# EAGLE design ESC Board 1 (EAGLE 7.5.0)
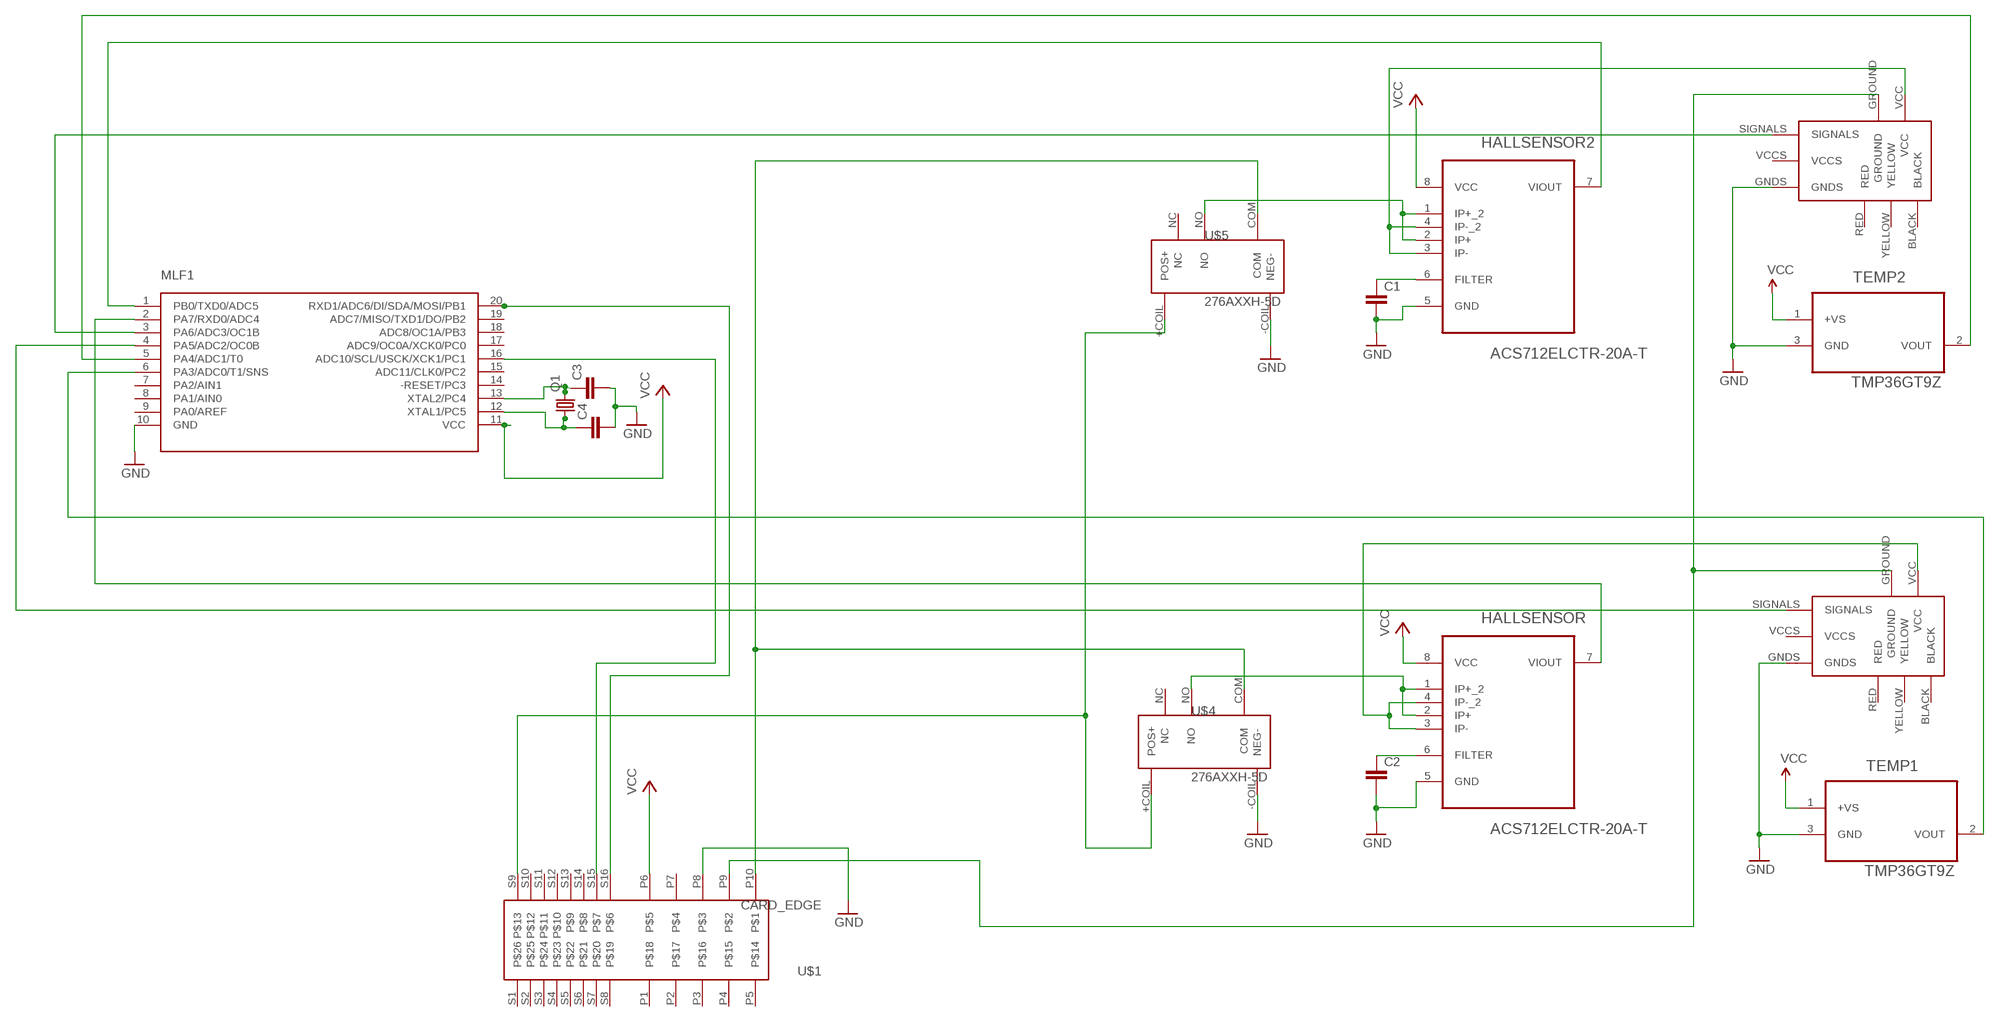
[diagram p0: schematic, sheet 1]

## Parts
C1  CAPEZ  [CAP-PTH-SMALLEZ]
C2  CAPEZ  [CAP-PTH-SMALLEZ]
C3  CAPEZ  [CAP-PTH-SMALLEZ]
C4  CAPEZ  [CAP-PTH-SMALLEZ]
HALLSENSOR  ACS712ELCTR-20A-T  [SOIC127P600X175-8N]
HALLSENSOR2  ACS712ELCTR-20A-T  [SOIC127P600X175-8N]
MLF1  ATTINY1634SOIC20  [SOIC20]
Q1  CRYTALTC26V  [TC26V]
TEMP1  TMP36GT9Z  [TO127P254X533-3P]
TEMP2  TMP36GT9Z  [TO127P254X533-3P]
U$1  CARD_EDGE  [EDGE_CONNECTOR]
U$2  ESC30A  [30AESC]
U$3  ESC30A  [30AESC]
U$4  276AXXH-5D  [276AXXH-5D]
U$5  276AXXH-5D  [276AXXH-5D]

## Nets
BAT-: U$1.P9 U$2.GROUND U$3.GROUND
GND: C1.2 C2.2 C3.2 C4.2 HALLSENSOR2.5(GND) HALLSENSOR.5(GND) MLF1.10(GND) TEMP1.3(GND) TEMP2.3(GND) U$1.P8 U$2.GNDS U$3.GNDS U$4.-COIL(NEG-) U$5.-COIL(NEG-)
N$1: MLF1.5(PA4/ADC1/T0) TEMP2.2(VOUT)
N$2: MLF1.6(PA3/ADC0/T1/SNS) TEMP1.2(VOUT)
N$3: MLF1.20(RXD1/ADC6/DI/SDA/MOSI/PB1) U$1.S16
N$4: MLF1.16(ADC10/SCL/USCK/XCK1/PC1) U$1.S15
N$5: HALLSENSOR2.7(VIOUT) MLF1.1(PB0/TXD0/ADC5)
N$6: HALLSENSOR.7(VIOUT) MLF1.2(PA7/RXD0/ADC4)
N$7: C3.1 MLF1.13(XTAL2/PC4) Q1.2
N$8: C4.1 MLF1.12(XTAL1/PC5) Q1.1
N$9: C1.1 HALLSENSOR2.6(FILTER)
N$10: HALLSENSOR2.3(IP-) HALLSENSOR2.4(IP-_2) U$3.VCC
N$11: U$1.P10 U$4.COM U$5.COM
N$12: HALLSENSOR.3(IP-) HALLSENSOR.4(IP-_2) U$2.VCC
N$13: MLF1.4(PA5/ADC2/OC0B) U$2.SIGNALS
N$14: MLF1.3(PA6/ADC3/OC1B) U$3.SIGNALS
N$15: C2.1 HALLSENSOR.6(FILTER)
N$16: HALLSENSOR.1(IP+_2) HALLSENSOR.2(IP+) U$4.NO
N$17: HALLSENSOR2.1(IP+_2) HALLSENSOR2.2(IP+) U$5.NO
N$19: U$1.S9 U$4.+COIL(POS+) U$5.+COIL(POS+)
VCC: HALLSENSOR2.8(VCC) HALLSENSOR.8(VCC) MLF1.11(VCC) TEMP1.1(+VS) TEMP2.1(+VS) U$1.P6
Unconnected: MLF1.7(PA2/AIN1) MLF1.8(PA1/AIN0) MLF1.9(PA0/AREF) MLF1.14(-RESET/PC3) MLF1.15(ADC11/CLK0/PC2) MLF1.17(ADC9/OC0A/XCK0/PC0) MLF1.18(ADC8/OC1A/PB3) MLF1.19(ADC7/MISO/TXD1/DO/PB2) U$1.P1 U$1.P2 U$1.P3 U$1.P4 U$1.P5 U$1.P7 U$1.S1 U$1.S2 U$1.S3 U$1.S4 U$1.S5 U$1.S6 U$1.S7 U$1.S8 U$1.S10 U$1.S11 U$1.S12 U$1.S13 U$1.S14 U$2.BLACK U$2.RED U$2.VCCS U$2.YELLOW U$3.BLACK U$3.RED U$3.VCCS U$3.YELLOW U$4.NC U$5.NC

## Library data of the parts
C1-C4 = SparkFun-Capacitors:CAP: Capacitor Standard 0603 ceramic capacitor, and 0.1" leaded capacitor.
HALLSENSOR HALLSENSOR2 = Allegro_By_element14_Batch_1:ACS712ELCTR-20A-T: Linear Current Sensor; MPN: ACS712ELCTR-20A-T; OC_FARNELL: 1329624; OC_NEWARK: 31M3133; PACKAGE: SOIC-8; SUPPLIER: Allegro
MLF1 = attiny1634:ATTINY1634
Q1 = crystal:CRYTAL: CRYSTAL
TEMP1 TEMP2 = ADI-Phase-2:TMP36GT9Z: Voltage Output Temperature Sensors; MPN: TMP36GT9Z; OC_FARNELL: 1438760; OC_NEWARK: 19M9015; PACKAGE: TO-92; SUPPLIER: Analog Devices
U$1 = Molex_Edge:CARD_EDGE
U$2 U$3 = ESC-30A:ESC30A
U$4 U$5 = Schneider Relay:276AXXH-5D

## Board
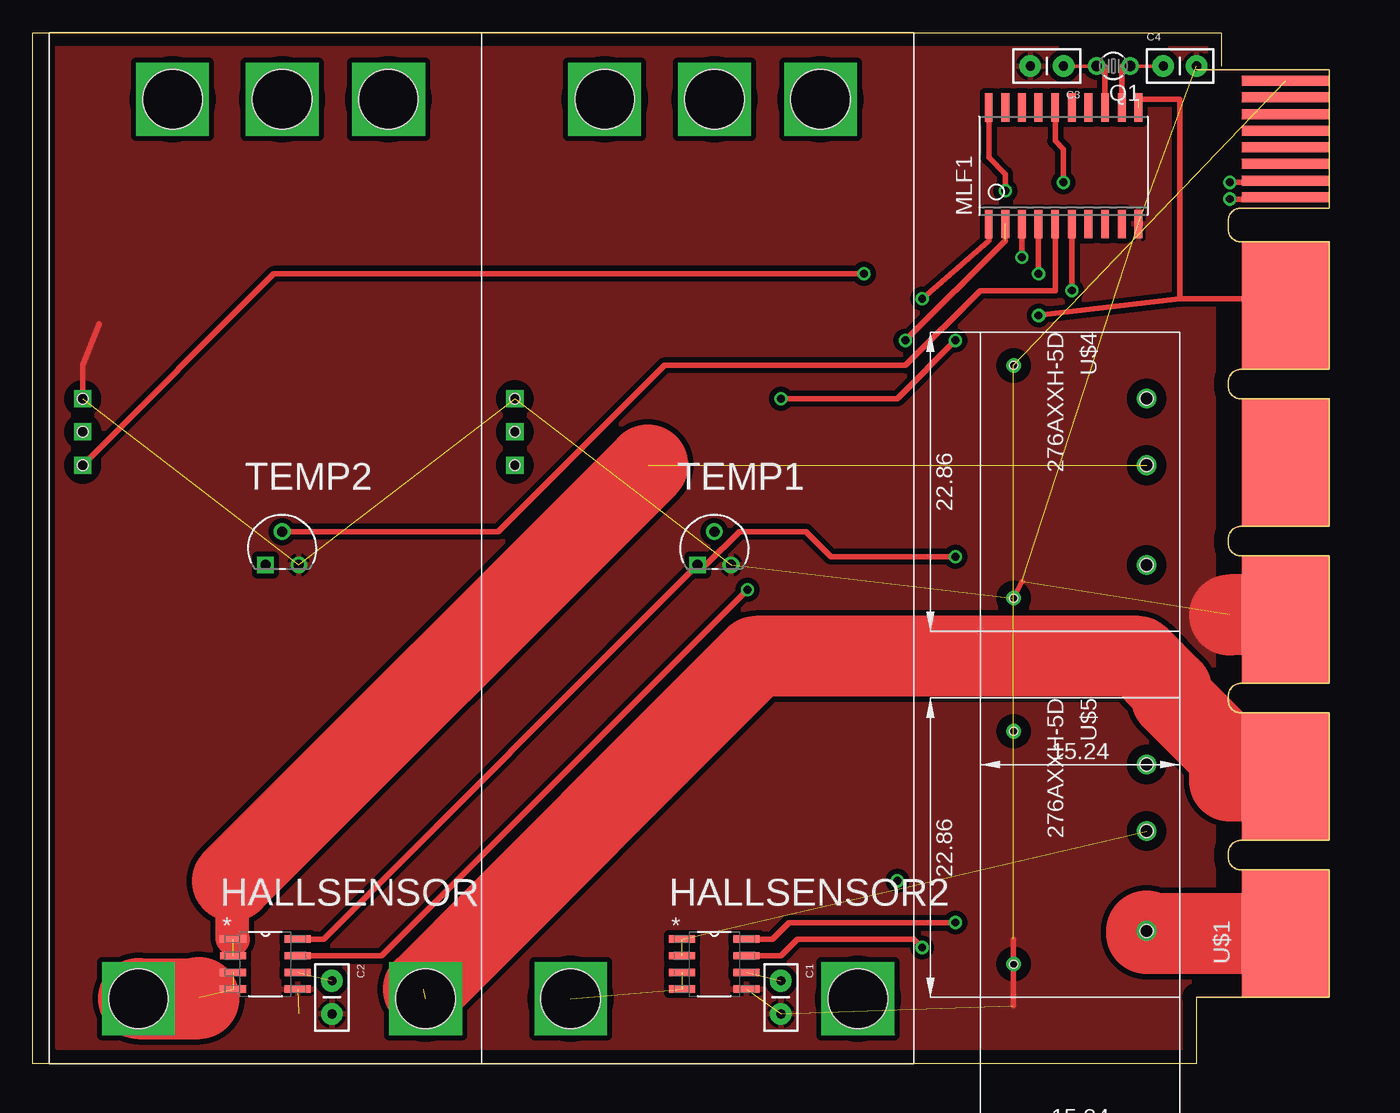
[diagram p1: board, top side]
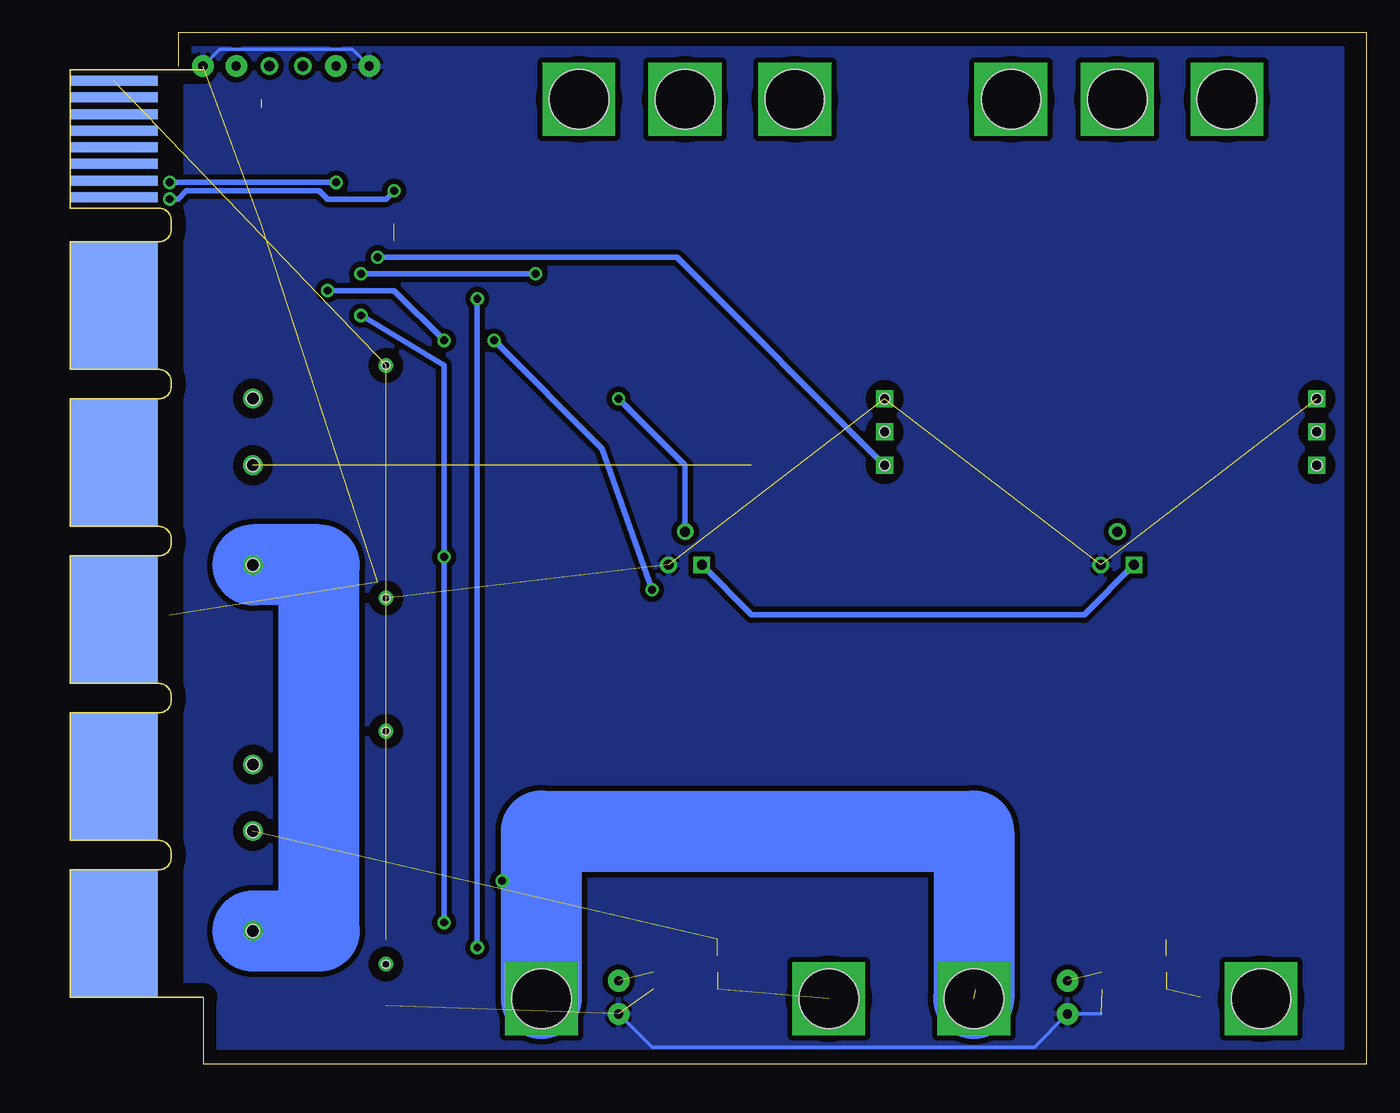
[diagram p2: board, bottom side, seen from below]

Size 99.06 x 78.74 mm. Coordinates in mm from the lower left corner, seen from the top.
Outline: 88.9,5.08 88.9,0 0,0 0,78.74 90.81,78.74 90.81,76.2
Copper layers (1*16): Top 0.035mm / dielectric 1.5mm / Bottom 0.035mm
Design rules "default": minimum track width 10mil, minimum drill 24mil, track to track 8mil, track to pad 8mil, pad to pad 8mil, via to via 8mil, smd to smd 8mil, copper to edge 40mil, drill to drill 8mil, minimum pad ring 10mil, minimum via ring 8mil, stop-mask expansion 4mil, vias tented up to drill 0mil, thermal gap 10mil

### Footprints (pad centres in the part's own frame; a part is rotated, then mirrored left to right if it is on the bottom)
CAP-PTH-SMALLEZ = drill 0.7 pad 1.651: 1 0,0; 2 2.54,0
SOIC127P600X175-8N = smd 1.981 x 0.559: 1 -2.464,1.905; 2 -2.464,0.635; 3 -2.464,-0.635; 4 -2.464,-1.905; 5 2.464,-1.905; 6 2.464,-0.635; 7 2.464,0.635; 8 2.464,1.905
SOIC20 = smd 0.6 x 2.2: 1 -1.905,-4.445; 2 -0.635,-4.445; 3 0.635,-4.445; 4 1.905,-4.445; 5 3.175,-4.445; 6 4.445,-4.445; 7 5.715,-4.445; 8 6.985,-4.445; 9 8.255,-4.445; 10 9.525,-4.445; 11 9.525,4.445; 12 8.255,4.445; 13 6.985,4.445; 14 5.715,4.445; 15 4.445,4.445; 16 3.175,4.445; 17 1.905,4.445; 18 0.635,4.445; 19 -0.635,4.445; 20 -1.905,4.445
TC26V = drill 0.813: 1 -1.27,0; 2 1.27,0
TO127P254X533-3P = drill 0.762 square: 1 -2.54,-2.54 | drill 0.762: 2 -1.27,0; 3 0,-2.54
EDGE_CONNECTOR = smd 9.728 x 6.706 bottom: P1 52.87,3.35; P2 40.87,3.35; P3 28.87,3.35; P4 16.87,3.35 | smd 9.73 x 6.7 bottom: P5 4.87,3.35 | smd 9.728 x 6.706: P6 52.87,3.35; P7 40.87,3.35; P8 28.87,3.35; P9 16.87,3.35 | smd 9.73 x 6.7: P10 4.87,3.35 | smd 0.76 x 6.7 bottom: S1 69.99,3.35; S2 68.72,3.35; S3 67.45,3.35; S4 66.18,3.35; S5 64.91,3.35; S6 63.64,3.35; S7 62.37,3.35; S8 61.1,3.35 | smd 0.76 x 6.7: S9 69.99,3.35; S10 68.72,3.35; S11 67.45,3.35; S12 66.18,3.35; S13 64.91,3.35; S14 63.64,3.35; S15 62.37,3.35; S16 61.1,3.35
30AESC = drill 4.547 square: BLACK -33.02,-8.382; GROUND 35.662,10.973; RED -33.02,8.128; VCC 35.662,-10.973; YELLOW -33.02,0 | drill 0.8 square: GNDS -10.16,-15.24; SIGNALS -5.08,-15.24; VCCS -7.62,-15.24 | hole 4.547: -33.02,0; -33.02,8.115; -33.02,-8.369; 35.662,-10.973; 35.662,10.973 | hole 0.8: -10.16,-15.24; -7.62,-15.24; -5.08,-15.24
276AXXH-5D = drill 0.6: +COIL -7.62,-2.54; -COIL 10.16,-2.54 | drill 1: COM 7.62,7.62; NC -5.08,7.62; NO 0,7.62 | hole 1: 0,7.62; -5.08,7.62; 7.62,7.62 | hole 0.6: -7.62,-2.54; 10.16,-2.54

### Placement (x,y rotation side)
C1  57.15,6.35 270 top
C2  22.86,6.35 270 top
C3  78.74,76.2 180 top
C4  86.36,76.2 0 top
HALLSENSOR  17.78,7.62 0 top
HALLSENSOR2  52.07,7.62 0 top
MLF1  74.93,68.58 0 top
Q1  82.55,76.2 180 top
TEMP1  53.34,40.64 0 top
TEMP2  20.32,40.64 0 top
U$1  99.06,5.08 90 top
U$2  19.05,40.64 270 top
U$3  52.07,40.64 270 top
U$4  77.47,45.72 270 top
U$5  77.47,17.78 270 top

### Tracks (layer width: path | path; a pad name or v marks a point on that pad's centre or on a via)
BAT-  (via drill 0.61)  (1 unrouted)
  Top 0.254: 95.25,21.59 U$1.P9
  Top 6.198: 95.25,21.59 91.44,21.59 91.44,23.5 87,27.94 87,28.57 84.45,31.11 55.24,31.11 29.84,5.71
  Bottom 0.254: v66.04,13.97 63.04,13.97
  Bottom 6.198: U$3.GROUND 63.04,13.97 63.04,17.78 30.02,17.78 U$2.GROUND
GND  (11 unrouted)
  Top 0.254: 95.25,34.29 U$1.P8
  Top 0.406: U$2.GNDS 3.81,53.34 5.08,56.52 | 74.93,4.45 U$5.-COIL 74.93,9.53 | U$4.-COIL 75.56,36.83
  Top 6.198: 95.25,34.29 91.44,34.29
  Bottom 0.254: 20.32,3.81 C2.2 25.4,1.27 54.61,1.27 C1.2 | C3.2 77.47,77.47 87.63,77.47 C4.2
  pour Top (isolate 0.406): 1.91,78.11 90.17,78.11 90.17,1.27 1.91,1.27
  pour Bottom (isolate 0.406): 1.91,78.11 90.17,78.11 90.17,1.27 1.91,1.27
N$1
  Top 0.406: MLF1.5 78.11,59.05 72.39,59.05 66.67,53.34 48.26,53.34 35.56,40.64 TEMP2.2
N$2  (via drill 0.6)
  Top 0.406: MLF1.6 v79.38,59.05 | v70.48,55.24 66.04,50.8 v57.15,50.8
  Bottom 0.406: v79.38,59.05 74.3,59.05 v70.48,55.24 | v57.15,50.8 52.07,45.72 TEMP1.2
N$3  (via drill 0.6)
  Top 0.406: MLF1.20 73.03,69.22 74.3,67.94 v74.3,66.67 | v91.44,66.04 95.25,66.04 U$1.S16
  Bottom 0.406: v74.3,66.67 74.93,66.04 79.38,66.04 80.01,66.67 90.17,66.67 90.81,66.04 v91.44,66.04
N$4  (via drill 0.6)
  Top 0.406: v78.74,67.31 78.74,69.85 78.11,70.48 MLF1.16 | v91.44,67.31 95.25,67.31 U$1.S15
  Bottom 0.406: v91.44,67.31 v78.74,67.31
N$5  (via drill 0.6)
  Top 0.406: MLF1.1 73.03,62.87 v67.94,58.42 | HALLSENSOR2.7 57.15,8.26 58.42,9.53 67.31,9.53 v67.94,8.89
  Bottom 0.406: v67.94,8.89 v67.94,58.42
N$6  (via drill 0.6)  (1 unrouted)
  Top 0.406: HALLSENSOR.7 26.67,8.26 v54.61,36.2 | v66.67,55.24 74.3,62.87
  Bottom 0.406: v54.61,36.2 58.42,46.99 v66.67,55.24
N$7
  Top 0.254: C3.1 Q1.2
  Top 0.406: Q1.2 81.92,76.2 MLF1.13
N$8
  Top 0.254: C4.1 Q1.1
  Top 0.406: Q1.1 83.19,76.2 MLF1.12
N$9  (1 unrouted)
N$10  (2 unrouted)
N$11
  Top 6.198: U$1.P10 85.09,9.95 U$5.COM
  Bottom 6.198: U$5.COM 80.01,10.16 80.01,38.1 U$4.COM
N$12  (2 unrouted)
  Top 6.198: U$2.VCC 12.7,4.98 12.7,5.08
N$13  (via drill 0.6)
  Top 0.406: MLF1.4 v76.83,60.33 | v63.5,60.33 18.41,60.33 U$2.SIGNALS
  Bottom 0.406: v76.83,60.33 v63.5,60.33
N$14  (via drill 0.6)
  Top 0.406: MLF1.3 v75.56,61.59
  Bottom 0.406: v75.56,61.59 52.7,61.59 U$3.SIGNALS
N$15  (1 unrouted)
N$16  (2 unrouted)
  Top 2.54: 15.24,13.97 15.24,9.6 HALLSENSOR.1
  Top 6.198: 46.99,45.72 15.24,13.97
N$17  (2 unrouted)
N$18  (via drill 0.6)
  other vias: 70.48,38.73
N$19  (2 unrouted)
VCC  (via drill 0.6)  (1 unrouted)
  Top 0.254: 95.25,57.15 U$1.P6
  Top 0.406: U$1.P6 95.71,58.42 87.63,58.42 | 87.63,58.42 87.63,73.66 84.45,73.66 | HALLSENSOR2.8 56.52,9.53 57.78,10.79 v70.48,10.79 | v76.83,57.15 87.63,58.42 | v70.48,38.73 60.96,38.73 59.05,40.64 53.98,40.64 51.44,38.1 TEMP1.1 22.23,9.53 HALLSENSOR.8
  Bottom 0.406: v76.83,57.15 70.48,53.34 v70.48,38.73 v70.48,10.79 | TEMP2.1 21.59,34.29 46.99,34.29 TEMP1.1